# EAGLE schematic OSSIComms (EAGLE 6.1)

## Sheet 1 of 4
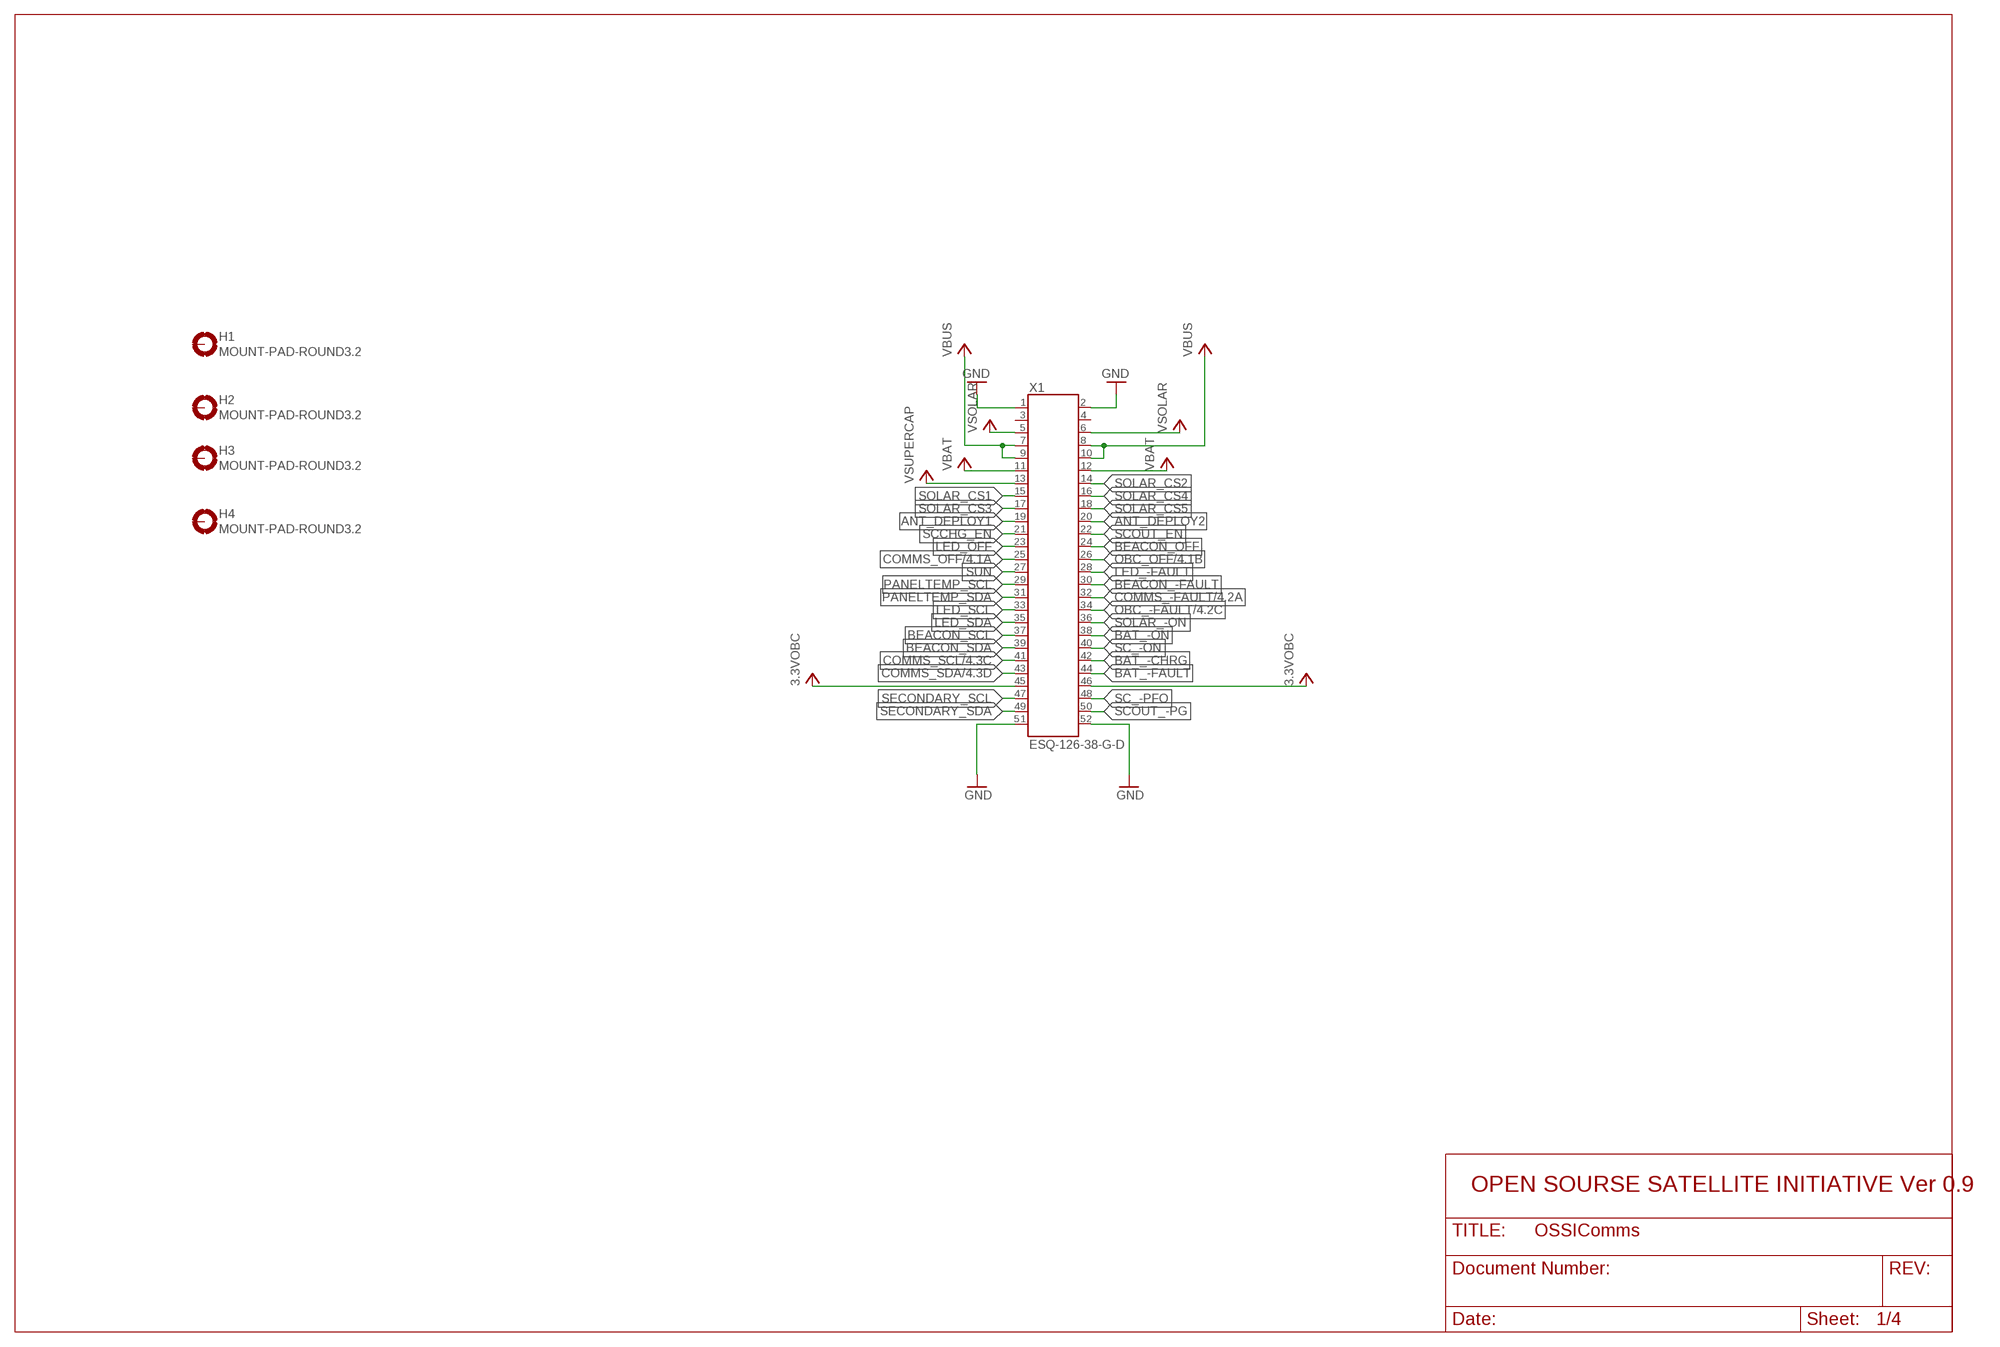
[diagram p0: schematic, sheet 1]

### Parts
H1  MOUNT-PAD-ROUND3.2  [3.2-PAD-ROUND]
H2  MOUNT-PAD-ROUND3.2  [3.2-PAD-ROUND]
H3  MOUNT-PAD-ROUND3.2  [3.2-PAD-ROUND]
H4  MOUNT-PAD-ROUND3.2  [3.2-PAD-ROUND]
X1  ESQ-126-38-G-D  [ESQ-126-XX-X-D]

### Nets
3.3VOBC: X1.45 X1.46
ANT_DEPLOY1: X1.19
ANT_DEPLOY2: X1.20
BAT_-CHRG: X1.42
BAT_-FAULT: X1.44
BAT_-ON: X1.38
BEACON_-FAULT: X1.30
BEACON_OFF: X1.24
BEACON_SCL: X1.37
BEACON_SDA: X1.39
COMMS_-FAULT: X1.32 ; also sheet 4
COMMS_OFF: X1.25 ; also sheet 4
COMMS_SCL: X1.41 ; also sheet 4
COMMS_SDA: X1.43 ; also sheet 4
GND: X1.1 X1.2 X1.51 X1.52 ; also sheet 2,3,4
LED_-FAULT: X1.28
LED_OFF: X1.23
LED_SCL: X1.33
LED_SDA: X1.35
OBC_-FAULT: X1.34 ; also sheet 4
OBC_OFF: X1.26 ; also sheet 4
PANELTEMP_SCL: X1.29
PANELTEMP_SDA: X1.31
SC_-ON: X1.40
SC_-PFO: X1.48
SCCHG_EN: X1.21
SCOUT_-PG: X1.50
SCOUT_EN: X1.22
SECONDARY_SCL: X1.47
SECONDARY_SDA: X1.49
SOLAR_-ON: X1.36
SOLAR_CS1: X1.15
SOLAR_CS2: X1.14
SOLAR_CS3: X1.17
SOLAR_CS4: X1.16
SOLAR_CS5: X1.18
SUN: X1.27
VBAT: X1.11 X1.12
VBUS: X1.7 X1.8 X1.9 X1.10 ; also sheet 2,4
VSOLAR: X1.5 X1.6
VSUPERCAP: X1.13
Unconnected: H1.B3,2(MOUNT) H2.B3,2(MOUNT) H3.B3,2(MOUNT) H4.B3,2(MOUNT) X1.3 X1.4

### Notes on the sheet
- OPEN SOURSE SATELLITE INITIATIVE Ver 0.9

## Sheet 2 of 4
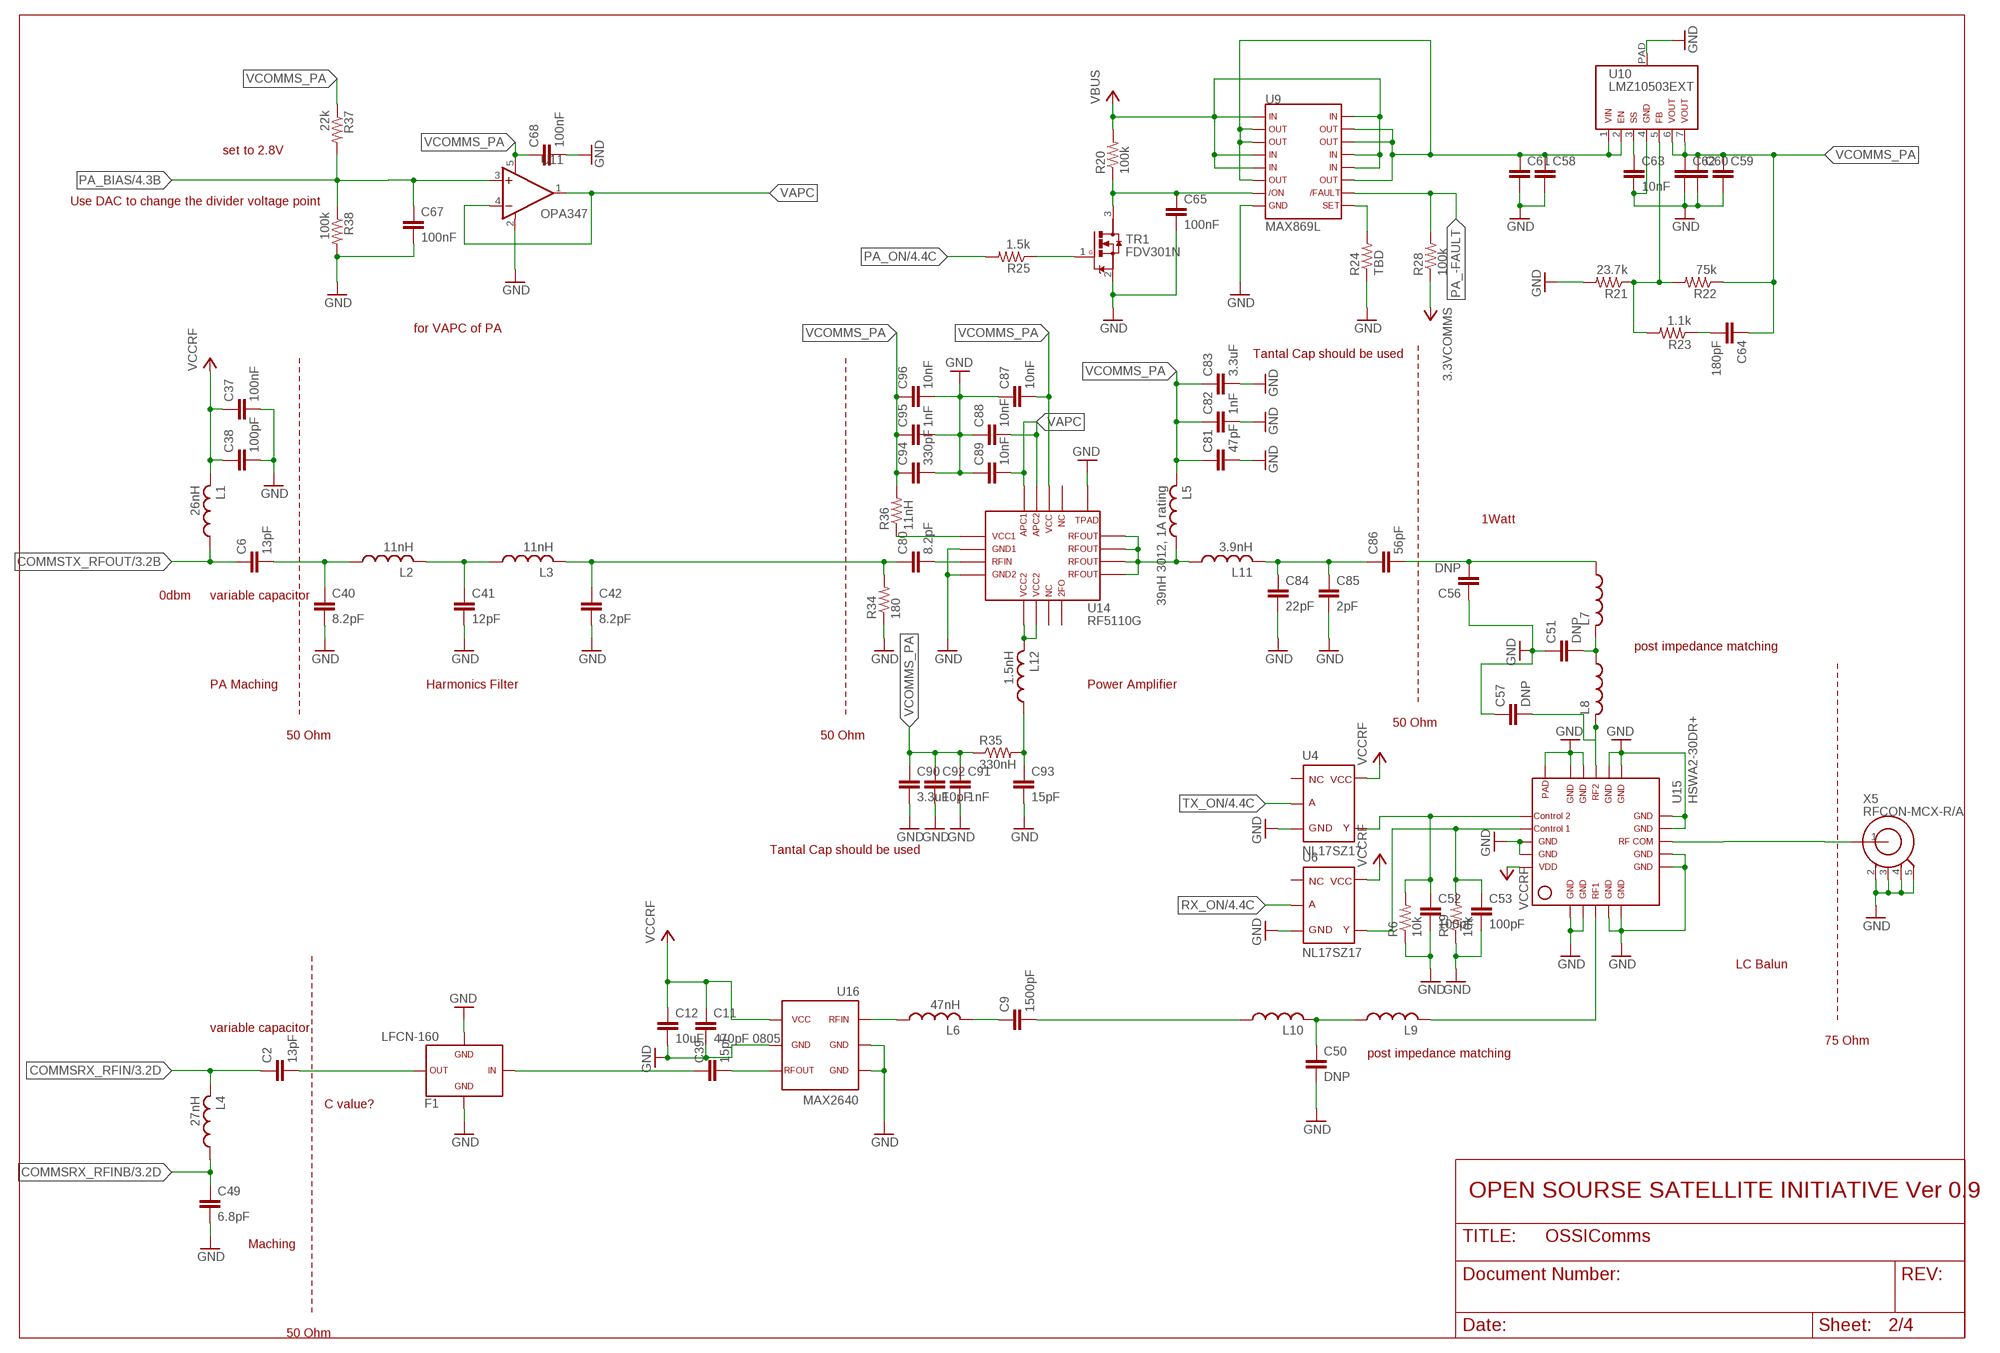
[diagram p1: schematic, sheet 2]

### Parts
C2  13pF  C0603(1608)  [C0603(1608)]
C6  13pF  C0603(1608)  [C0603(1608)]
C9  1500pF  C0603(1608)  [C0603(1608)]
C11  470pF 0805  C0805(2012)  [C0805(2012)]
C12  10uF  C1206(3216)-GCM31  [C1206-GCM31]
C37  100nF  C0603(1608)  [C0603(1608)]
C38  100pF  C0603(1608)  [C0603(1608)]
C39  15pF  C0603(1608)  [C0603(1608)]
C40  8.2pF  C0603(1608)  [C0603(1608)]
C41  12pF  C0603(1608)  [C0603(1608)]
C42  8.2pF  C0603(1608)  [C0603(1608)]
C49  6.8pF  C0603(1608)  [C0603(1608)]
C50  DNP  C0603(1608)  [C0603(1608)]
C51  DNP  C0603(1608)  [C0603(1608)]
C52  100pF  C0603(1608)  [C0603(1608)]
C53  100pF  C0603(1608)  [C0603(1608)]
C56  DNP  C0603(1608)  [C0603(1608)]
C57  DNP  C0603(1608)  [C0603(1608)]
C58  C1210(3225)-GCM32  [C1210-GCM32]
C59  C1210(3225)-GCM32  [C1210-GCM32]
C60  C1210(3225)-GCM32  [C1210-GCM32]
C61  C1210(3225)-GCM32  [C1210-GCM32]
C62  C0805(2012)  [C0805(2012)]
C63  10nF  C0603(1608)  [C0603(1608)]
C64  180pF  C0603(1608)  [C0603(1608)]
C65  100nF  C0603(1608)  [C0603(1608)]
C67  100nF  C0603(1608)  [C0603(1608)]
C68  100nF  C0603(1608)  [C0603(1608)]
C80  8.2pF  C0603(1608)  [C0603(1608)]
C81  47pF  C0603(1608)  [C0603(1608)]
C82  1nF  C0603(1608)  [C0603(1608)]
C83  3.3uF  C1210(3225)-TMK325  [C1210-TMK325]
C84  22pF  C0603(1608)  [C0603(1608)]
C85  2pF  C0603(1608)  [C0603(1608)]
C86  56pF  C0603(1608)  [C0603(1608)]
C87  10nF  C0603(1608)  [C0603(1608)]
C88  10nF  C0603(1608)  [C0603(1608)]
C89  10nF  C0603(1608)  [C0603(1608)]
C90  3.3uF  C1210(3225)-TMK325  [C1210-TMK325]
C91  1nF  C0603(1608)  [C0603(1608)]
C92  10pF  C0603(1608)  [C0603(1608)]
C93  15pF  C0603(1608)  [C0603(1608)]
C94  330pF  C0603(1608)  [C0603(1608)]
C95  1nF  C0603(1608)  [C0603(1608)]
C96  10nF  C0603(1608)  [C0603(1608)]
F1  LFCN-160  [LFCN]
L1  26nH  L0603(1608)  [L0603(1608)]
L2  11nH  L0603(1608)  [L0603(1608)]
L3  11nH  L0603(1608)  [L0603(1608)]
L4  27nH  L0603(1608)  [L0603(1608)]
L5  39nH 3012, 1A rating  LNR3012  [NR3012]
L6  47nH  L0603(1608)  [L0603(1608)]
L7  L0603(1608)  [L0603(1608)]
L8  L0603(1608)  [L0603(1608)]
L9  L0603(1608)  [L0603(1608)]
L10  L0603(1608)  [L0603(1608)]
L11  3.9nH  L0603(1608)  [L0603(1608)]
L12  1.5nH  L0603(1608)  [L0603(1608)]
R6  10k  R0603(1608)  [R0603(1608)]
R19  10k  R0603(1608)  [R0603(1608)]
R20  100k  R0603(1608)  [R0603(1608)]
R21  23.7k  R0603(1608)  [R0603(1608)]
R22  75k  R0603(1608)  [R0603(1608)]
R23  1.1k  R0603(1608)  [R0603(1608)]
R24  TBD  R0603(1608)  [R0603(1608)]
R25  1.5k  R0603(1608)  [R0603(1608)]
R28  100k  R0603(1608)  [R0603(1608)]
R34  180  R0603(1608)  [R0603(1608)]
R35  330nH  R0603(1608)  [R0603(1608)]
R36  11nH  R0603(1608)  [R0603(1608)]
R37  22k  R0603(1608)  [R0603(1608)]
R38  100k  R0603(1608)  [R0603(1608)]
TR1  FDV301N  [SOT23]
U4  NL17SZ17  [SOT-553]
U6  NL17SZ17  [SOT-553]
U9  MAX869L  [16QSOP]
U10  LMZ10503EXT  [TO-PMOD-7]
U11  OPA347  [SOT23-5DBV]
U14  RF5110G  [RF5110G]
U15  HSWA2-30DR+  [DG983-1]
U16  MAX2640  [SOT23-6]
X5  RFCON-MCX-R/A  [MCX-R/A]

### Nets
3.3VCOMMS: R28.1 ; also sheet 4
COMMSRX_RFIN: C2.1 L4.2 ; also sheet 3
COMMSRX_RFINB: C49.1 L4.1 ; also sheet 3
COMMSTX_RFOUT: C6.1 L1.1 ; also sheet 3
GND: C11.2 C12.P$2 C37.2 C38.2 C40.2 C41.2 C42.2 C49.2 C50.2 C51.1 C52.2 C53.2 C56.1 C57.1 C58.P$2 C59.P$2 C60.P$2 C61.P$2 C62.2 C63.2 C65.2 C67.2 C68.2 C81.2 C82.2 C83.P$2 C84.2 C85.2 C87.1 C88.1 C89.1 C90.P$2 C91.2 C92.2 C93.2 C94.2 C95.2 C96.2 F1.2 F1.4 R6.1 R19.1 R21.2 R24.1 R34.1 R38.2 TR1.2(S) U4.3 U6.3 U9.8 U10.4 U10.PAD U11.2(V-) U14.2 U14.4 U14.TPAD U15.1 U15.2 U15.4 U15.5 U15.6 U15.7 U15.9 U15.10 U15.11 U15.12 U15.14 U15.15 U15.18 U15.19 U15.PAD U16.2 U16.3 U16.5 X5.2 X5.3 X5.4 X5.5 ; also sheet 1,3,4
N$4: C56.2 C86.2 L7.1
N$7: L6.1 U16.1
N$8: C9.1 L6.2
N$14: C39.2 U16.4
N$15: C50.1 L9.1 L10.2
N$16: C2.2 F1.3
N$21: L9.2 U15.3
N$23: C51.2 L7.2 L8.1
N$33: C42.1 C80.1 L3.2 R34.2
N$36: C6.2 C40.1 L2.1
N$37: C41.1 L2.2 L3.1
N$39: C57.2 L8.2 U15.13
N$41: C39.1 F1.1
N$42: C52.1 R6.2 U4.4 U15.16
N$43: C9.2 L10.1
N$44: C53.1 R19.2 U6.4 U15.17
N$46: U15.8 X5.1
N$47: C65.1 R20.1 TR1.3(D) U9.7
N$50: C63.1 U10.3
N$51: R25.1 TR1.1(G)
N$52: C58.P$1 C61.P$1 U9.2 U9.3 U9.6 U9.11 U9.14 U9.15 U10.1 U10.2
N$53: R21.1 R22.2 R23.2 U10.5
N$54: C64.2 R23.1
N$55: R24.2 U9.9
N$71: C84.1 C85.1 C86.1 L11.2
N$72: L12.2 U14.5 U14.6
N$73: C80.2 U14.3
N$75: L5.P$1 L11.1 U14.9 U14.10 U14.11 U14.12
N$79: C93.1 L12.1 R35.2
N$80: R36.1 U14.1
PA_-FAULT: R28.2 U9.10
PA_BIAS: C67.1 R37.2 R38.1 U11.3(+IN) ; also sheet 4
PA_ON: R25.2 ; also sheet 4
RX_ON: U6.2 ; also sheet 4
TX_ON: U4.2 ; also sheet 4
VAPC: C88.2 C89.2 U11.1(OUT) U11.4(-IN) U14.15 U14.16
VBUS: R20.2 U9.1 U9.4 U9.5 U9.12 U9.13 U9.16 ; also sheet 1,4
VCCRF: C11.1 C12.P$1 C37.1 C38.1 L1.2 U4.5 U6.5 U15.20 U16.6 ; also sheet 3,4
VCOMMS_PA: C59.P$1 C60.P$1 C62.1 C64.1 C68.1 C81.1 C82.1 C83.P$1 C87.2 C90.P$1 C91.1 C92.1 C94.1 C95.1 C96.1 L5.P$2 R22.1 R35.1 R36.2 R37.1 U10.6 U10.7 U11.5(V+) U14.14
Unconnected: U4.1 U6.1 U14.7 U14.8 U14.13

### Notes on the sheet
- set to 2.8V
- Use DAC to change the divider voltage point
- for VAPC of PA
- Tantal Cap should be used
- 1Watt
- 0dbm | variable capacitor
- post impedance matching
- PA Maching | Harmonics Filter | Power Amplifier
- 50 Ohm
- 50 Ohm | 50 Ohm
- Tantal Cap should be used
- LC Balun
- variable capacitor
- 75 Ohm
- post impedance matching
- C value?
- OPEN SOURSE SATELLITE INITIATIVE Ver 0.9
- Maching
- 50 Ohm

## Sheet 3 of 4
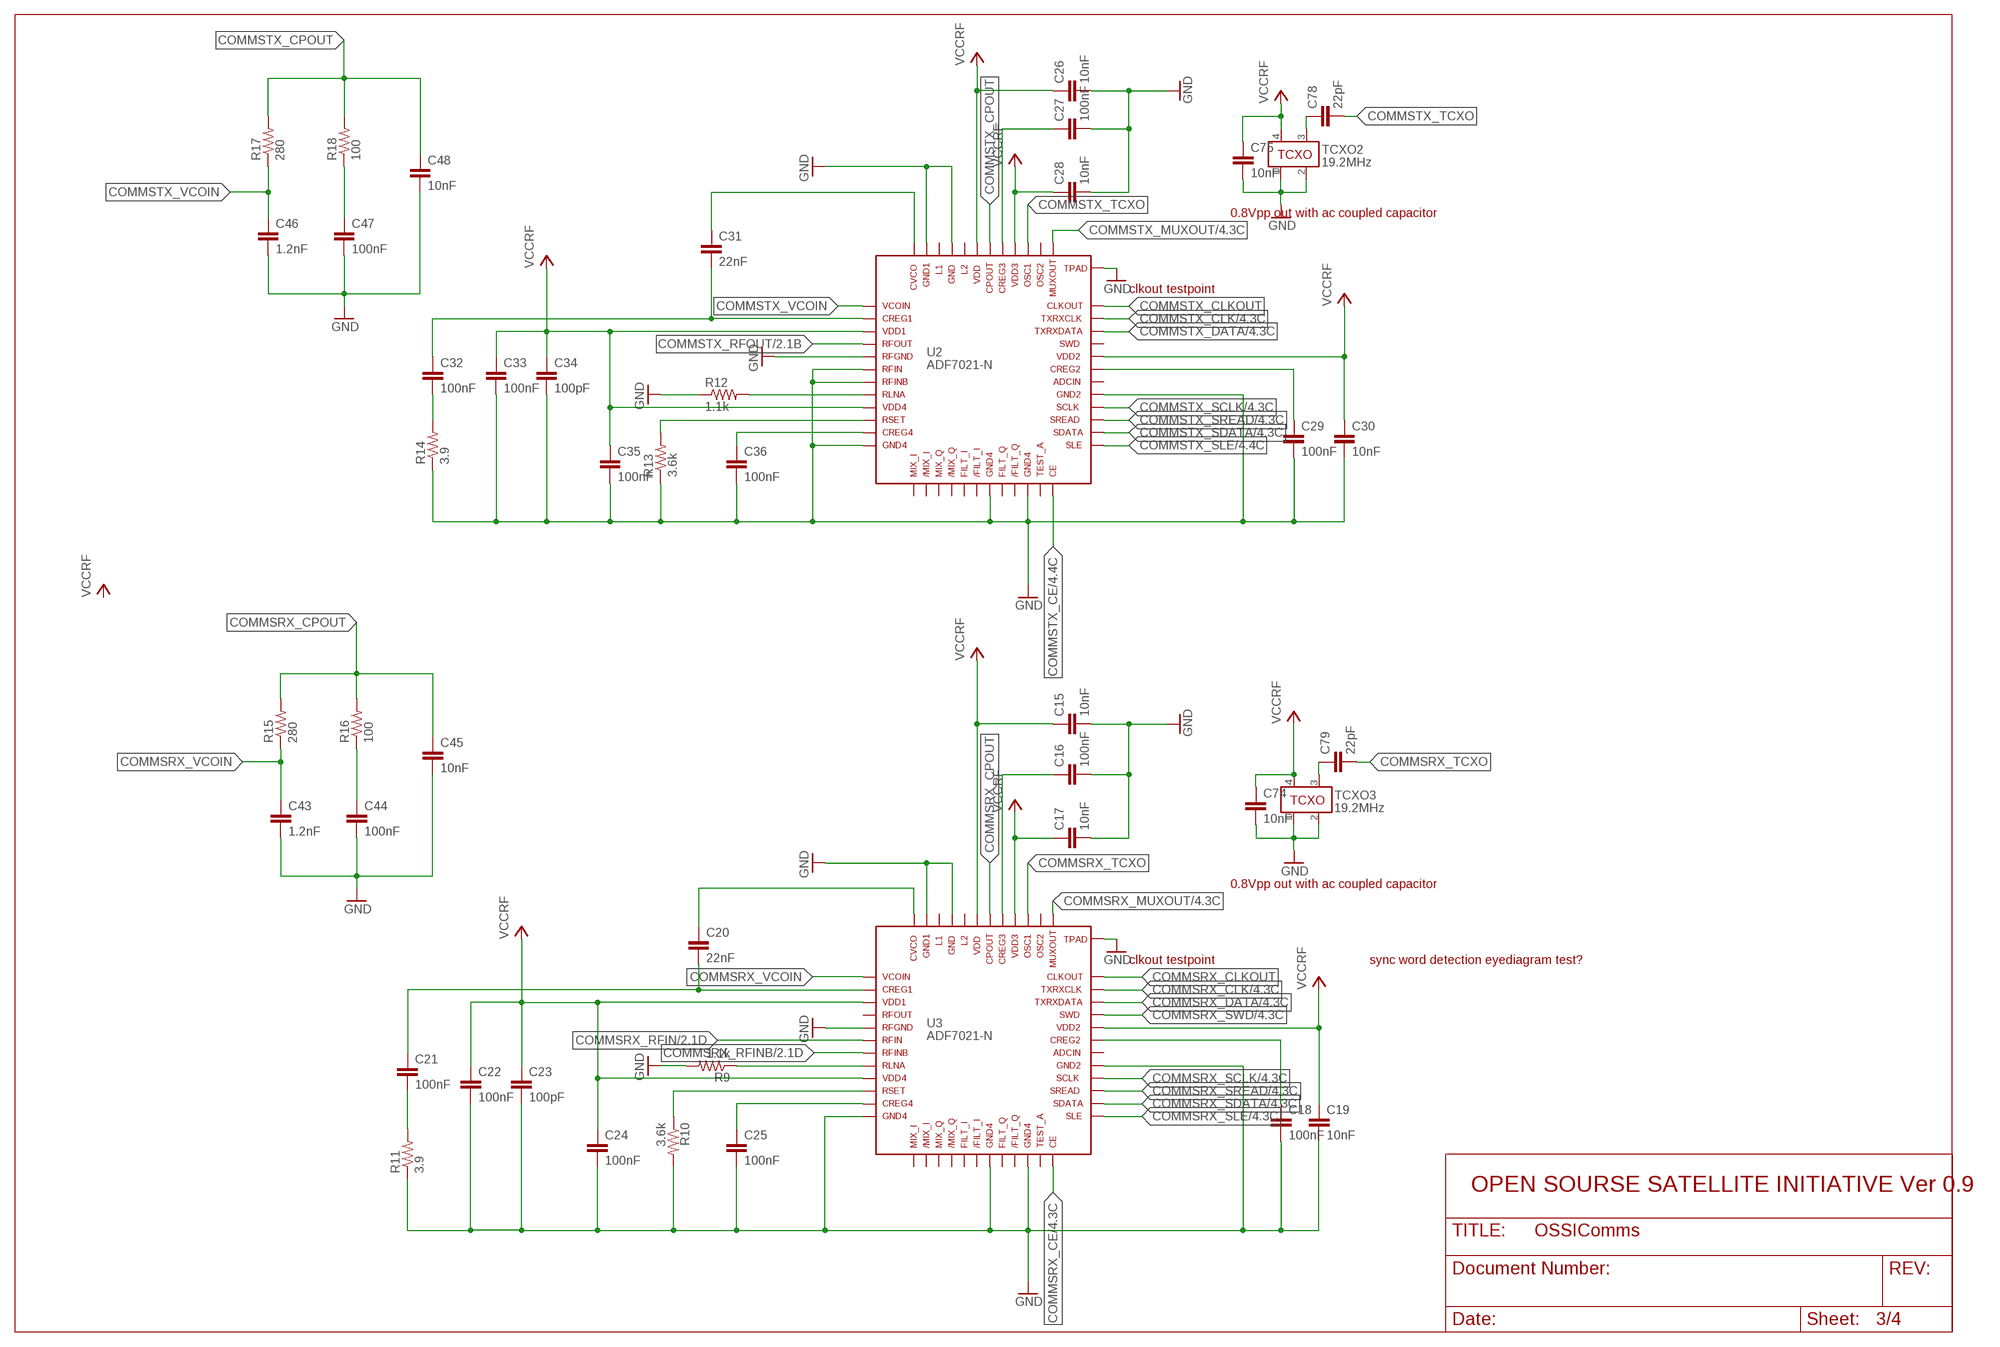
[diagram p2: schematic, sheet 3]

### Parts
C15  10nF  C0603(1608)  [C0603(1608)]
C16  100nF  C0603(1608)  [C0603(1608)]
C17  10nF  C0603(1608)  [C0603(1608)]
C18  100nF  C0603(1608)  [C0603(1608)]
C19  10nF  C0603(1608)  [C0603(1608)]
C20  22nF  C0603(1608)  [C0603(1608)]
C21  100nF  C0603(1608)  [C0603(1608)]
C22  100nF  C0603(1608)  [C0603(1608)]
C23  100pF  C0603(1608)  [C0603(1608)]
C24  100nF  C0603(1608)  [C0603(1608)]
C25  100nF  C0603(1608)  [C0603(1608)]
C26  10nF  C0603(1608)  [C0603(1608)]
C27  100nF  C0603(1608)  [C0603(1608)]
C28  10nF  C0603(1608)  [C0603(1608)]
C29  100nF  C0603(1608)  [C0603(1608)]
C30  10nF  C0603(1608)  [C0603(1608)]
C31  22nF  C0603(1608)  [C0603(1608)]
C32  100nF  C0603(1608)  [C0603(1608)]
C33  100nF  C0603(1608)  [C0603(1608)]
C34  100pF  C0603(1608)  [C0603(1608)]
C35  100nF  C0603(1608)  [C0603(1608)]
C36  100nF  C0603(1608)  [C0603(1608)]
C43  1.2nF  C0603(1608)  [C0603(1608)]
C44  100nF  C0603(1608)  [C0603(1608)]
C45  10nF  C0603(1608)  [C0603(1608)]
C46  1.2nF  C0603(1608)  [C0603(1608)]
C47  100nF  C0603(1608)  [C0603(1608)]
C48  10nF  C0603(1608)  [C0603(1608)]
C74  10nF  C0603(1608)  [C0603(1608)]
C75  10nF  C0603(1608)  [C0603(1608)]
C78  22pF  C0603(1608)  [C0603(1608)]
C79  22pF  C0603(1608)  [C0603(1608)]
R9  1.1k  R0603(1608)  [R0603(1608)]
R10  3.6k  R0603(1608)  [R0603(1608)]
R11  3.9  R0603(1608)  [R0603(1608)]
R12  1.1k  R0603(1608)  [R0603(1608)]
R13  3.6k  R0603(1608)  [R0603(1608)]
R14  3.9  R0603(1608)  [R0603(1608)]
R15  280  R0603(1608)  [R0603(1608)]
R16  100  R0603(1608)  [R0603(1608)]
R17  280  R0603(1608)  [R0603(1608)]
R18  100  R0603(1608)  [R0603(1608)]
TCXO2  19.2MHz  TCXO-M532  [TCXO_M532]
TCXO3  19.2MHz  TCXO-M532  [TCXO_M532]
U2  ADF7021-N  [LFCSP48]
U3  ADF7021-N  [LFCSP48]

### Nets
COMMSRX_CE: U3.24 ; also sheet 4
COMMSRX_CLK: U3.35 ; also sheet 4
COMMSRX_CLKOUT: U3.36
COMMSRX_CPOUT: C45.1 R15.2 R16.2 U3.42
COMMSRX_DATA: U3.34 ; also sheet 4
COMMSRX_MUXOUT: U3.37 ; also sheet 4
COMMSRX_RFIN: U3.6 ; also sheet 2
COMMSRX_RFINB: U3.7 ; also sheet 2
COMMSRX_SCLK: U3.28 ; also sheet 4
COMMSRX_SDATA: U3.26 ; also sheet 4
COMMSRX_SLE: U3.25 ; also sheet 4
COMMSRX_SREAD: U3.27 ; also sheet 4
COMMSRX_SWD: U3.33 ; also sheet 4
COMMSRX_TCXO: C79.2 U3.39
COMMSRX_VCOIN: C43.1 R15.1 U3.1
COMMSTX_CE: U2.24 ; also sheet 4
COMMSTX_CLK: U2.35 ; also sheet 4
COMMSTX_CLKOUT: U2.36
COMMSTX_CPOUT: C48.1 R17.2 R18.2 U2.42
COMMSTX_DATA: U2.34 ; also sheet 4
COMMSTX_MUXOUT: U2.37 ; also sheet 4
COMMSTX_RFOUT: U2.4 ; also sheet 2
COMMSTX_SCLK: U2.28 ; also sheet 4
COMMSTX_SDATA: U2.26 ; also sheet 4
COMMSTX_SLE: U2.25 ; also sheet 4
COMMSTX_SREAD: U2.27 ; also sheet 4
COMMSTX_TCXO: C78.2 U2.39
COMMSTX_VCOIN: C46.1 R17.1 U2.1
GND: C15.2 C16.2 C17.2 C18.2 C19.2 C22.2 C23.2 C24.2 C25.2 C26.2 C27.2 C28.2 C29.2 C30.2 C33.2 C34.2 C35.2 C36.2 C43.2 C44.2 C45.2 C46.2 C47.2 C48.2 C74.2 C75.2 R9.2 R10.2 R11.1 R12.1 R13.1 R14.1 TCXO2.1 TCXO2.2 TCXO3.1 TCXO3.2 U2.5 U2.6 U2.7 U2.12 U2.19 U2.22 U2.29 U2.45 U2.47 U2.EXP U3.5 U3.12 U3.19 U3.22 U3.29 U3.45 U3.47 U3.EXP ; also sheet 1,2,4
N$1: C16.1 U3.41
N$3: C36.1 U2.11
N$9: C18.1 U3.31
N$10: C25.1 U3.11
N$22: C20.1 U3.48
N$24: R9.1 U3.8
N$25: R10.1 U3.10
N$26: C21.2 R11.2
N$27: C31.1 U2.48
N$28: R13.2 U2.10
N$29: C32.2 R14.2
N$30: R12.2 U2.8
N$31: C27.1 U2.41
N$32: C29.1 U2.31
N$34: C31.2 C32.1 U2.2
N$35: C20.2 C21.1 U3.2
N$38: C47.1 R18.1
N$40: C44.1 R16.1
N$66: C79.1 TCXO3.3
N$68: C78.1 TCXO2.3
VCCRF: C15.1 C17.1 C19.1 C22.1 C23.1 C24.1 C26.1 C28.1 C30.1 C33.1 C34.1 C35.1 C74.1 C75.1 TCXO2.4 TCXO3.4 U2.3 U2.9 U2.32 U2.40 U2.43 U3.3 U3.9 U3.32 U3.40 U3.43 ; also sheet 2,4
Unconnected: U2.13 U2.14 U2.15 U2.16 U2.17 U2.18 U2.20 U2.21 U2.23 U2.30 U2.33 U2.38 U2.44 U2.46 U3.4 U3.13 U3.14 U3.15 U3.16 U3.17 U3.18 U3.20 U3.21 U3.23 U3.30 U3.38 U3.44 U3.46

### Notes on the sheet
- 0.8Vpp out with ac coupled capacitor
- clkout testpoint
- 0.8Vpp out with ac coupled capacitor
- clkout testpoint | sync word detection eyediagram test?
- OPEN SOURSE SATELLITE INITIATIVE Ver 0.9

## Sheet 4 of 4
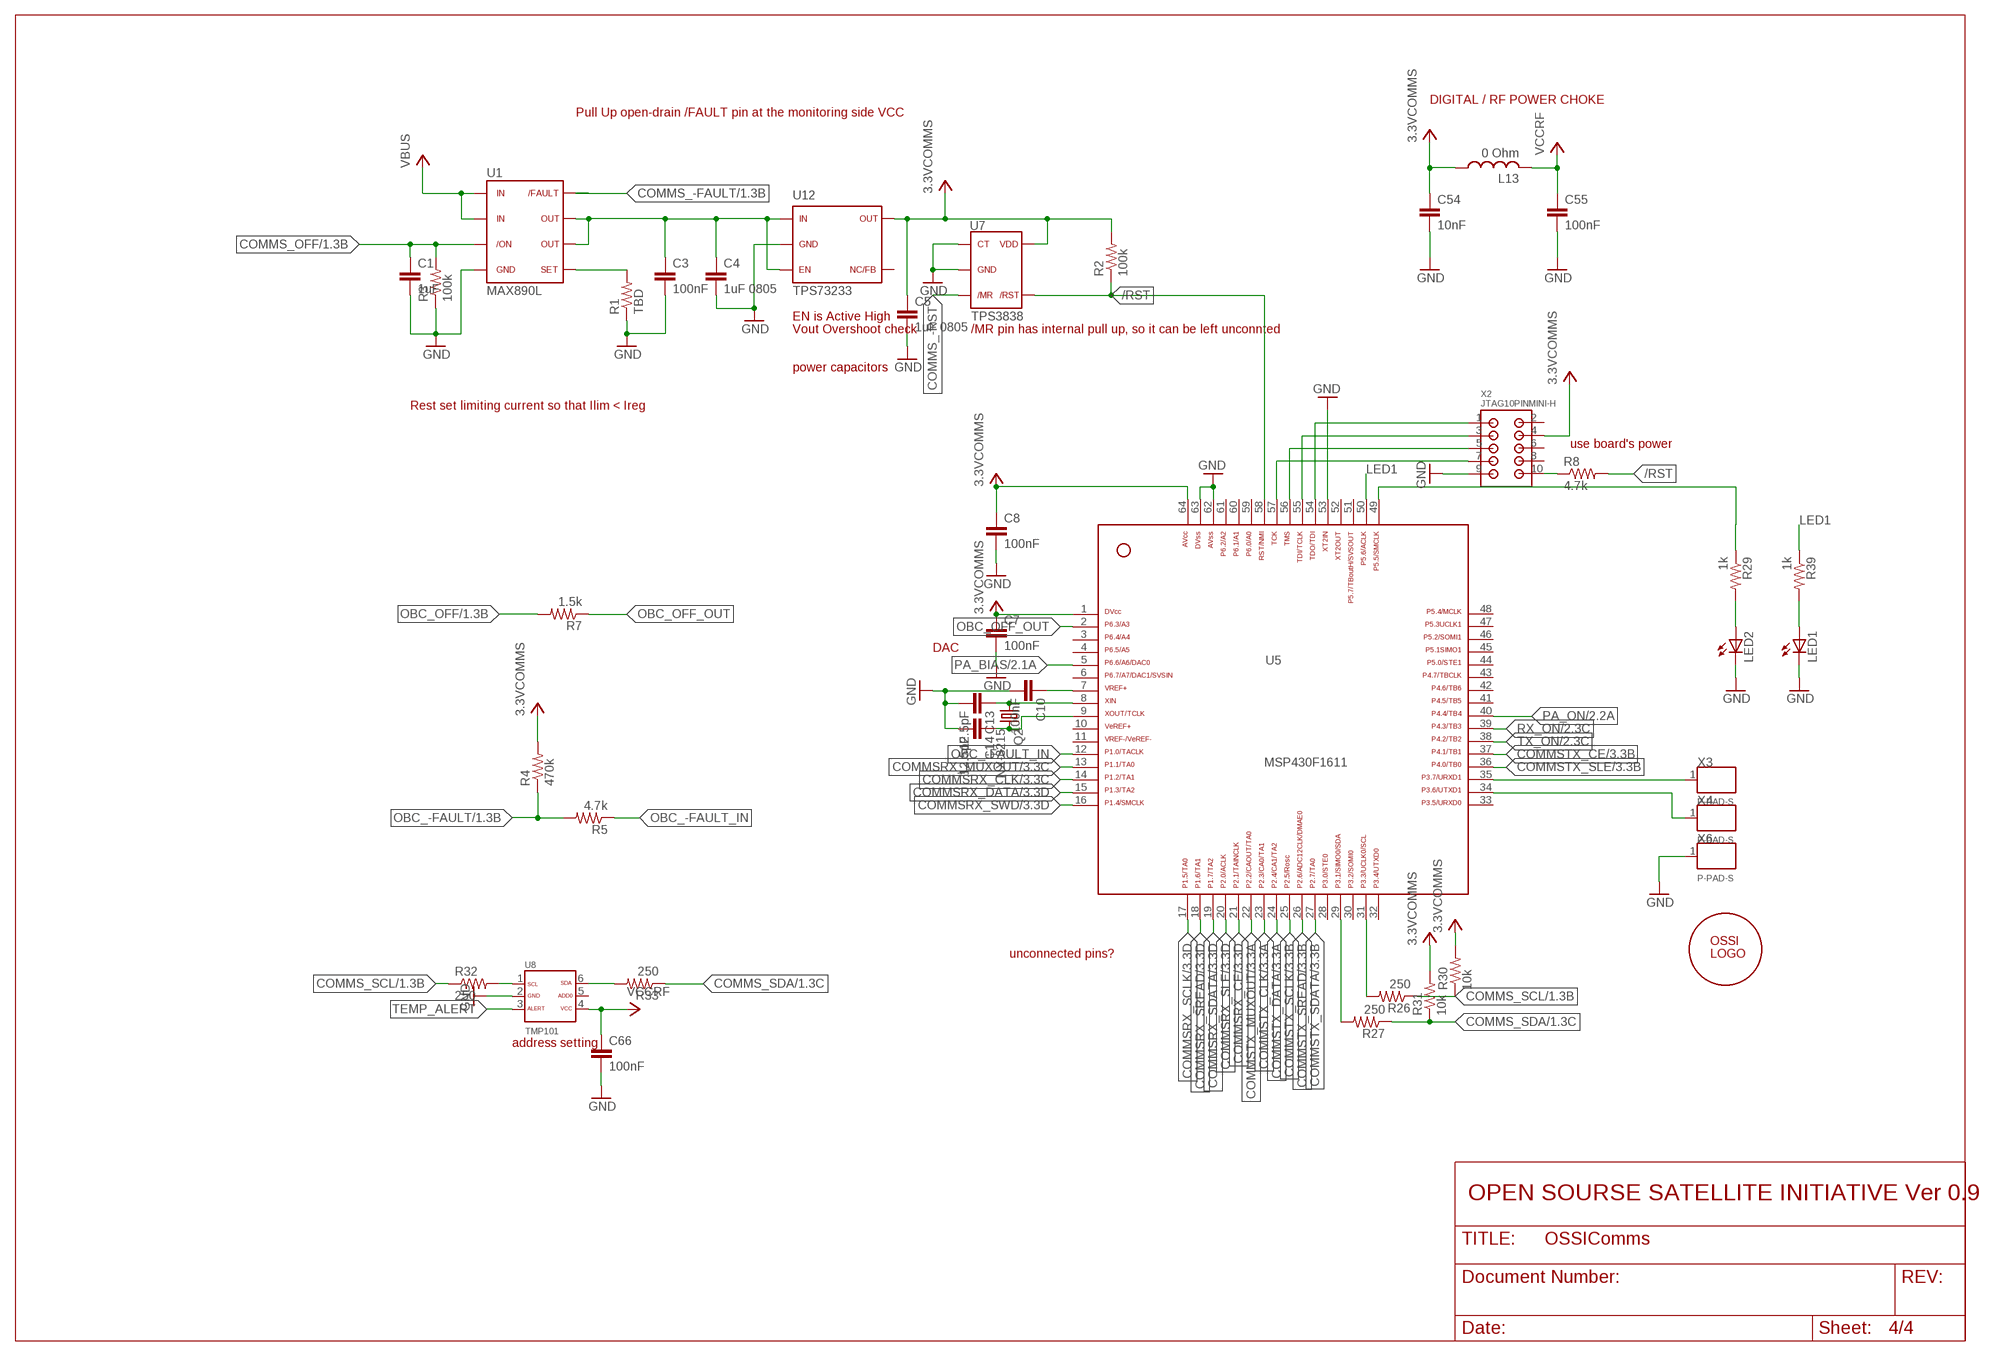
[diagram p3: schematic, sheet 4]

### Parts
C1  1uF  C0603(1608)  [C0603(1608)]
C3  100nF  C0603(1608)  [C0603(1608)]
C4  1uF 0805  C0805(2012)  [C0805(2012)]
C5  1uF 0805  C0805(2012)  [C0805(2012)]
C7  100nF  C0603(1608)  [C0603(1608)]
C8  100nF  C0603(1608)  [C0603(1608)]
C10  100nF  C0603(1608)  [C0603(1608)]
C13  12.5pF  C0603(1608)  [C0603(1608)]
C14  12.5pF  C0603(1608)  [C0603(1608)]
C54  10nF  C0603(1608)  [C0603(1608)]
C55  100nF  C0603(1608)  [C0603(1608)]
C66  100nF  C0603(1608)  [C0603(1608)]
L13  0 Ohm  L0805(2012)  [L0805(2012)]
LED1  LEDCHIPLED_0603  [CHIPLED_0603]
LED2  LEDCHIPLED_0603  [CHIPLED_0603]
Q2  NX-3215  [NX-3215]
R1  TBD  R0603(1608)  [R0603(1608)]
R2  100k  R0603(1608)  [R0603(1608)]
R3  100k  R0603(1608)  [R0603(1608)]
R4  470k  R0603(1608)  [R0603(1608)]
R5  4.7k  R0603(1608)  [R0603(1608)]
R7  1.5k  R0603(1608)  [R0603(1608)]
R8  4.7k  R0603(1608)  [R0603(1608)]
R26  250  R0603(1608)  [R0603(1608)]
R27  250  R0603(1608)  [R0603(1608)]
R29  1k  R0603(1608)  [R0603(1608)]
R30  10k  R0603(1608)  [R0603(1608)]
R31  10k  R0603(1608)  [R0603(1608)]
R32  250  R0603(1608)  [R0603(1608)]
R33  250  R0603(1608)  [R0603(1608)]
R39  1k  R0603(1608)  [R0603(1608)]
U1  MAX890L  [SO8]
U5  MSP430F1611  [PM/PAG64]
U7  TPS3838  [SOT23-5DBV]
U8  TMP101  [SOT23-6DBV]
U12  TPS73233  [SOT23-5DBV]
U$1  OSSILOGORECT  [OSSILOGORECT1005]
X2  JTAG10PINMINI-H  [M50-3200545]
X3  P-PAD-S  [P-PAD-S]
X4  P-PAD-S  [P-PAD-S]
X6  P-PAD-S  [P-PAD-S]

### Nets
3.3VCOMMS: C5.1 C7.1 C8.1 C54.1 L13.1 R2.2 R4.2 R30.2 R31.2 U5.1 U5.64 U7.5 U12.5 X2.4 ; also sheet 2
/RST: R2.1 R8.2 U5.58 U7.4
COMMS_-FAULT: U1.8 ; also sheet 1
COMMS_-RST: U7.3
COMMS_OFF: C1.1 R3.2 U1.3 ; also sheet 1
COMMS_SCL: R26.1 R30.1 R32.1 ; also sheet 1
COMMS_SDA: R27.1 R31.1 R33.1 ; also sheet 1
COMMSRX_CE: U5.21 ; also sheet 3
COMMSRX_CLK: U5.14 ; also sheet 3
COMMSRX_DATA: U5.15 ; also sheet 3
COMMSRX_MUXOUT: U5.13 ; also sheet 3
COMMSRX_SCLK: U5.17 ; also sheet 3
COMMSRX_SDATA: U5.19 ; also sheet 3
COMMSRX_SLE: U5.20 ; also sheet 3
COMMSRX_SREAD: U5.18 ; also sheet 3
COMMSRX_SWD: U5.16 ; also sheet 3
COMMSTX_CE: U5.37 ; also sheet 3
COMMSTX_CLK: U5.23 ; also sheet 3
COMMSTX_DATA: U5.24 ; also sheet 3
COMMSTX_MUXOUT: U5.22 ; also sheet 3
COMMSTX_SCLK: U5.25 ; also sheet 3
COMMSTX_SDATA: U5.27 ; also sheet 3
COMMSTX_SLE: U5.36 ; also sheet 3
COMMSTX_SREAD: U5.26 ; also sheet 3
GND: C1.2 C3.2 C4.2 C5.2 C7.2 C8.2 C10.2 C13.2 C14.2 C54.2 C55.2 C66.2 LED1.C LED2.C R1.1 R3.1 U1.4 U5.53 U5.62 U5.63 U7.1 U7.2 U8.2 U12.2 X2.9 X6.1 ; also sheet 1,2,3
LED1: R39.1 U5.50
N$2: R8.1 X2.10
N$5: C13.1 Q2.1 U5.8
N$6: C14.1 Q2.2 U5.9
N$11: C3.1 C4.1 U1.6 U1.7 U12.1 U12.3
N$12: R1.2 U1.5
N$13: C10.1 U5.7
N$17: U5.57 X2.7
N$18: U5.56 X2.5
N$19: U5.55 X2.3
N$20: U5.54 X2.1
N$45: LED2.A R29.2
N$48: R29.1 U5.49
N$49: LED1.A R39.2
N$56: U5.35 X3.1
N$57: U5.34 X4.1
N$60: R27.2 U5.29
N$61: R26.2 U5.31
N$62: R33.2 U8.6
N$63: R32.2 U8.1
OBC_-FAULT: R4.1 R5.2 ; also sheet 1
OBC_-FAULT_IN: R5.1 U5.12
OBC_OFF: R7.2 ; also sheet 1
OBC_OFF_OUT: R7.1 U5.2
PA_BIAS: U5.5 ; also sheet 2
PA_ON: U5.40 ; also sheet 2
RX_ON: U5.39 ; also sheet 2
TEMP_ALERT: U8.3
TX_ON: U5.38 ; also sheet 2
VBUS: U1.1 U1.2 ; also sheet 1,2
VCCRF: C55.1 C66.1 L13.2 U8.4 ; also sheet 2,3
Unconnected: U5.3 U5.4 U5.6 U5.10 U5.11 U5.28 U5.30 U5.32 U5.33 U5.41 U5.42 U5.43 U5.44 U5.45 U5.46 U5.47 U5.48 U5.51 U5.52 U5.59 U5.60 U5.61 U8.5 U12.4 X2.2 X2.6 X2.8

### Notes on the sheet
- DIGITAL / RF POWER CHOKE
- Pull Up open-drain /FAULT pin at the monitoring side VCC
- EN is Active High
- Vout Overshoot check | /MR pin has internal pull up, so it can be left unconnted
- power capacitors
- Rest set limiting current so that Ilim < Ireg
- use board's power
- DAC
- unconnected pins?
- address setting
- OPEN SOURSE SATELLITE INITIATIVE Ver 0.9

## Library data of the parts
C1-C68 C74 C75 C78-C96 = OSSI:C
F1 = OSSI:LFCN-160: LFCN-160 Low Pass Filter DC - 160MHz Low Pass Filter Cut Off Freq: 230MHz 8W power rating ( degraded to 3W at 100 celcius degree)
H1-H4 = OSSI:MOUNT-PAD-ROUND
L1-L13 = OSSI:L
LED1 LED2 = led:LED: LED OSRAM: - CHIPLED LG R971, LG N971, LY N971, LG Q971, LY Q971, LO R971, LY R971 LH N974, LH R974 LS Q976, LO Q976, LY Q976 LO Q996 - Hyper CHIPLED LW Q18S LB Q993, LB Q99A, LB R99A - SideLED LS A670, LO A670, LY A670, LG A670, LP A670 LB A673, LV A673, LT A673, LW A673 LH A674 LY A675 LS A676, LA A676, LO A676, LY A676, LW A676 LS A679, LY A679, LG A679 - Hyper Micro SIDELED® LS Y876, LA Y876, LO Y876, LY Y876 LT Y87S - SmartLED LW L88C, LW L88S LB L89C, LB L89S, LG L890 LS L89K, LO L89K, LY L89K LS L896, LA L896, LO L896, LY L896 - TOPLED LS T670, LO T670, LY T670, LG T670, LP T670 LSG T670, LSP T670, LSY T670, LOP T670, LYG T670 LG T671, LOG T671, LSG T671 LB T673, LV T673, LT T673, LW T673 LH T674 LS T676, LA T676, LO T676, LY T676, LB T676, LH T676, LSB T676, LW T676 LB T67C, LV T67C, LT T67C, LS T67K, LO T67K, LY T67K, LW E67C LS E67B, LA E67B, LO E67B, LY E67B, LB E67C, LV E67C, LT E67C LW T67C LS T679, LY T679, LG T679 LS T770, LO T770, LY T770, LG T770, LP T770 LB T773, LV T773, LT T773, LW T773 LH T774 LS E675, LA E675, LY E675, LS T675 LS T776, LA T776, LO T776, LY T776, LB T776 LHGB T686 LT T68C, LB T68C - Hyper Mini TOPLED® LB M676 - Mini TOPLED Santana® LG M470 LS M47K, LO M47K, LY M47K Source: http://www.osram.convergy.de LUXEON: - LUMILED® LXK2-PW12-R00, LXK2-PW12-S00, LXK2-PW14-U00, LXK2-PW14-V00 LXK2-PM12-R00, LXK2-PM12-S00, LXK2-PM14-U00 LXK2-PE12-Q00, LXK2-PE12-R00, LXK2-PE12-S00, LXK2-PE14-T00, LXK2-PE14-U00 LXK2-PB12-K00, LXK2-PB12-L00, LXK2-PB12-M00, LXK2-PB14-N00, LXK2-PB14-P00, LXK2-PB14-Q00 LXK2-PR12-L00, LXK2-PR12-M00, LXK2-PR14-Q00, LXK2-PR14-R00 LXK2-PD12-Q00, LXK2-PD12-R00, LXK2-PD12-S00 LXK2-PH12-R00, LXK2-PH12-S00 LXK2-PL12-P00, LXK2-PL12-Q00, LXK2-PL12-R00 Source: www.luxeon.com KINGBRIGHT: KA-3528ASYC Source: www.kingbright.com
Q2 = OSSI:NX-3215: NDK 32.768 kHz SMD Crystal P/N: NX3215SA-32.768K-STD-MUA-9 Nominal frequency (kHz): 32.768 Package Size (L×W×H : mm): 3.2×1.5×0.8 Operating Temperature Range(*1) / Storage Temperature Range (°C): -40 to +85 / -40 to +85 Level of drive: 0.1µW (Max. 0.5µW) Frequency Tolerance (25±3°C): ±20×10-6 Load Capacitance: 9.0pF, 12.5pF Equivalent Series Resistance: 70kΩ Max. Ordering Code: NX3215SA-32.768K-STD-MUA-9 (Load Capacitance9.0pF) /NX3215SA-32.768K-STD-MUA-8 (Load Capacitance12.5pF)
R1-R39 = OSSI:R
TCXO2 TCXO3 = OSSI:TCXO-M532: 532L25DT19M2000: CTO electronic components Model 532 19.2MHz TCXO for RF transeiver Clipped Sine Wave Output Operating Voltage, +3.3Vdc Operating Temperature to -30°C to +85°C Frequency Stability: ±2.5ppm
TR1 = OSSI:FDV301N: FDV301N Digital N channel - FET / Rdson = 5 Ohm / Vgs = 0.7~1.06V / Ids = 220mA
U1 = OSSI:MAX890L: MAX 890L 1.2A, Current-Limited, High-Side P-Channel Switch with Thermal Shutdown BY MAXIM
U2 U3 = OSSI:ADF7021-N: ADF7021-N RF transceiver from analog device
U4 U6 = OSSI:NL17SZ17: NL17S17 Single Non-Iverting Buffer with Schmitt Trigger Source/Sink 24mA at 3.0 Volts 1.65V ~ 5.5V Vcc Operation
U5 = OSSI:MSP430F1611: MSP430F1611
U7 = OSSI:TPS3838: TPS3838 NanoPower Supervisory IC from texas instruments. TPS3838 is open-drain output
U8 = OSSI:TMP101: TMP101 Digital Temerature Sensor with I2C Interface from Texas Instruments
U9 = OSSI:MAX869L: 2A, Current-Limited, High-Side P-Channel Switch with Thermal Shutdown
U10 = OSSI:LMZ10503EXT: LMZ10503EXT June 14, 2011 3A SIMPLE SWITCHER® Power Module with 5.5V Maximum Input Voltage for Military and Rugged Applications
U11 = OSSI:OPA347: OPA347 RAIL-TO-RAIL INPUT AND OUTPUT SINGLE SUPPLY: 2.3V to 5.5V LOW IQ: 20µ
U12 = OSSI:TPS732*: TPS732XX LDO 250mA / 40mV drop out EN pin is Active High!!
U14 = OSSI:RF5110G: RF5110G 3V GSM RF Power Amplifirer +36dBm Output Power at 3.5V
U15 = OSSI:HSWA2-30DR+: SPDT RF Switch Mini-Circuits +3V supply 50 Ohm matched DC ~3GHz DC ~3GHz Maximum input power: 33dBm
U16 = OSSI:MAX2640: MAX2640 ultra-low-noise amplifiers operating frequency: 300MHz to 2500MHz +2.7V to +5.5V Single-Supply Operation Low 3.5mA Supply Current
U$1 = OSSI:OSSILOGO
X1 = OSSI:ESQ-126-: Samtec ESQ-126-XX-G-D Elevated Sockets Seires ESQ-126-37-G-D ESQ-126-38-G-D ESQ-126-39-G-D
X2 = OSSI:JTAG10PINMINI
X3 X4 X6 = OSSI:P-PAD
X5 = OSSI:RFCON: RF Connectors